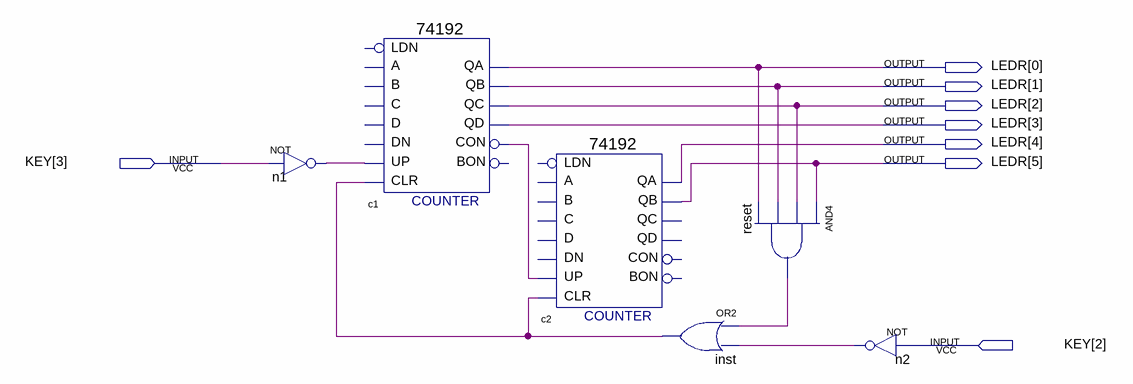
[diagram p0: schematic sheet]
// Quartus schematic 74192mod27.bdf as structural Verilog: 6 symbols, 8 pins
module \74192mod27  (
  input  [3:2] KEY,
  output [5:0] LEDR
);

  wire c1_con, inst_out, n1_out, n2_out, reset_out;

  not n1 (n1_out, KEY[3]);
  \74192  c1 (
    .CLR(inst_out), .UP(n1_out), .QB(LEDR[1]), .CON(c1_con), .QA(LEDR[0]), .QC(LEDR[2]), .QD(LEDR[3]));  // open: D, C, A, B, DN, LDN, BON
  \74192  c2 (.CLR(inst_out), .UP(c1_con), .QB(LEDR[5]), .QA(LEDR[4]));  // open: D, C, A, B, DN, LDN, BON, CON, QC, QD
  or inst (inst_out, reset_out, n2_out);
  and reset (reset_out, LEDR[5], LEDR[2], LEDR[1], LEDR[0]);
  not n2 (n2_out, KEY[2]);
endmodule
